# EAGLE design ESP32-S3 TFT Touch v1.1(3.5'' ili9488) (EAGLE 6.1)
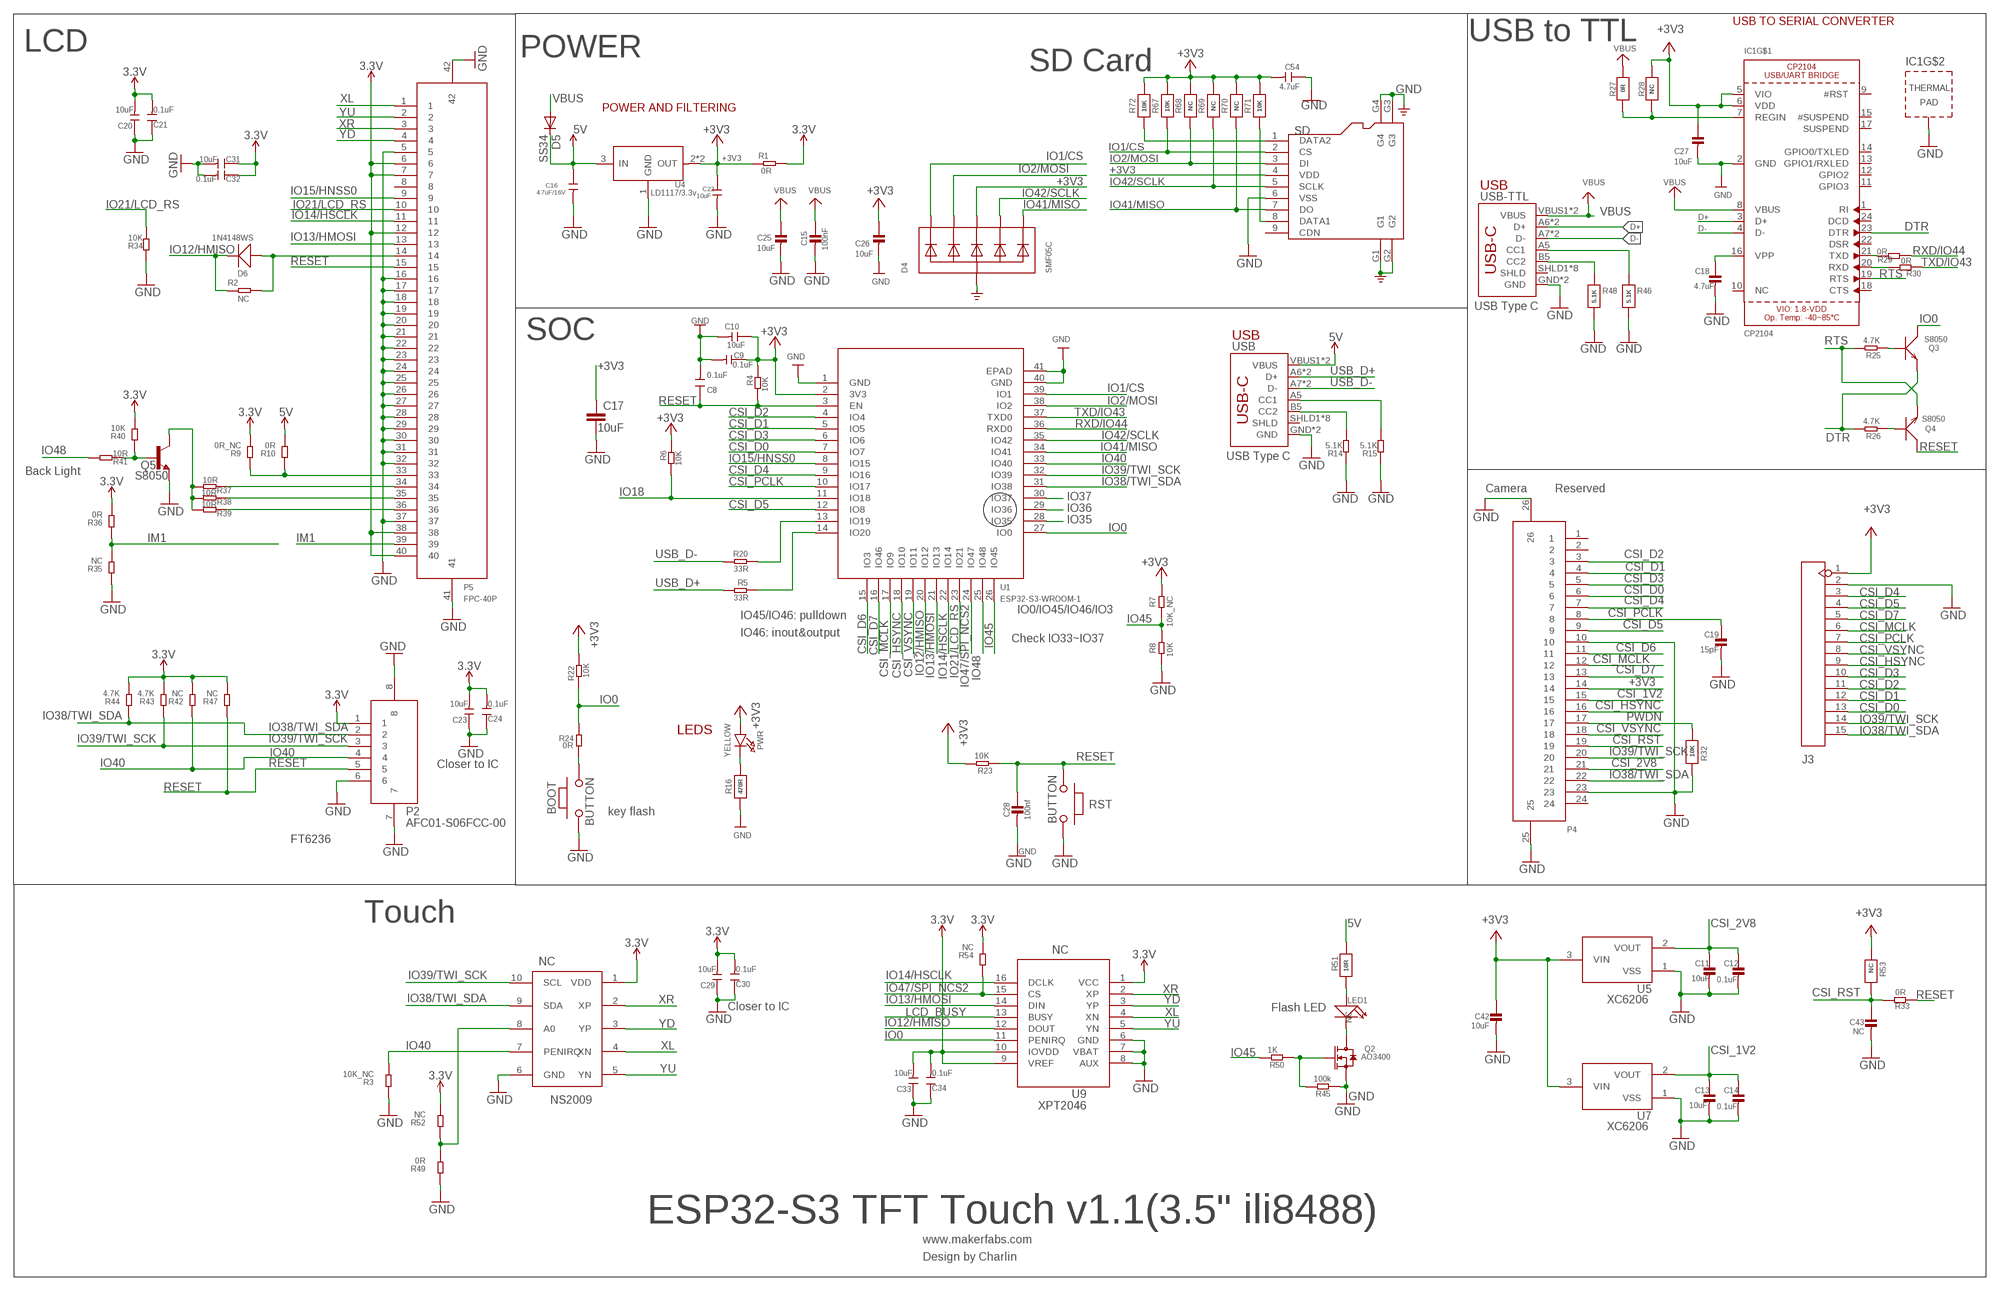
[diagram p0: schematic, sheet 1]

## Parts
BOOT  BUTTON  PB157  [157SW]
C8  0.1uF  DISCRETE_C-0603  [DISCRETE_C0603]
C9  0.1uF  DISCRETE_C-0603  [DISCRETE_C0603]
C10  10uF  DISCRETE_C-0603  [DISCRETE_C0603]
C11  10uF  CAP_CERAMIC0603_NO  [0603-NO]
C12  0.1uF  CAP_CERAMIC0603_NO  [0603-NO]
C13  10uF  CAP_CERAMIC0603_NO  [0603-NO]
C14  0.1uF  CAP_CERAMIC0603_NO  [0603-NO]
C15  100nF  CAP_CERAMIC0603_NO  [0603-NO]
C16  4.7uF/16V  C-0603  [0603]
C17  10uF  C-EUC0603  [C0603]
C18  4.7uF  CAP_CERAMIC0603_NO  [0603-NO]
C19  15pF  CAP_CERAMIC0603_NO  [0603-NO]
C20  10uF  DISCRETE_C-0603  [DISCRETE_C0603]
C21  0.1uF  DISCRETE_C-0603  [DISCRETE_C0603]
C22  10uF  C-0603  [0603]
C23  10uF  DISCRETE_C-0603  [DISCRETE_C0603]
C24  0.1uF  DISCRETE_C-0603  [DISCRETE_C0603]
C25  10uF  CAP_CERAMIC0603_NO  [0603-NO]
C26  10uF  CAP_CERAMIC0603_NO  [0603-NO]
C27  10uF  CAP_CERAMIC0603_NO  [0603-NO]
C28  100nf  CAP_CERAMIC0603_NO  [0603-NO]
C29  10uF  DISCRETE_C-0603  [DISCRETE_C0603]
C30  0.1uF  DISCRETE_C-0603  [DISCRETE_C0603]
C31  10uF  DISCRETE_C-0603  [DISCRETE_C0603]
C32  0.1uF  DISCRETE_C-0603  [DISCRETE_C0603]
C33  10uF  DISCRETE_C-0603  [DISCRETE_C0603]
C34  0.1uF  DISCRETE_C-0603  [DISCRETE_C0603]
C42  10uF  CAP_CERAMIC0603_NO  [0603-NO]
C43  NC  CAP_CERAMIC0603_NO  [0603-NO]
C54  4.7uF  DISCRETE_C-0603  [DISCRETE_C0603]
D4  SMF05C  TVSARRAY_5LANE  [SOT363]
D5  SS34  DIODE-DO-214AC  [DO-214AC]
D6  1N4148WS  D'0805'  [SOD323]
IC1  CP2104  [QFN24_4MM_SMSC]
J3  HEADER-1X15P  [SMD15-2.54P8.5H]
LED1  NC  DISCRETE_LED3528  [DISCRETE_LED-3528]
P2  AFC01-S06FCC-00  [SMD8-50P-740L535W]
P4  FPC-24P  [SMD26-50P-1760L450W]
P5  FPC-40P  [SMD42-50P-2560L490W]
PWR  YELLOW  LED0805_NOOUTLINE  [CHIPLED_0805_NOOUTLINE]
Q2  AO3400  MOSFET-N'SOT23'  [SOT23@1]
Q3  S8050  TRANSISTOR-NPN-SOT23  [SOT23]
Q4  S8050  TRANSISTOR-NPN-SOT23  [SOT23]
Q5  S8050  SPARKFUN_TRANSISTOR_NPNSOT23  [SPARKFUN_SOT23]
R1  0R  R-0603  [R0603]
R2  NC  R-0603  [R0603]
R3  10K_NC  DISCRETE_R-0603  [DISCRETE_R0603]
R4  10K  R-0603  [R0603]
R5  33R  R-0603  [R0603]
R6  10K  R-0603  [R0603]
R7  10K_NC  R-0603  [R0603]
R8  10K  R-0603  [R0603]
R9  0R_NC  DISCRETE_R-0603  [DISCRETE_R0603]
R10  0R  DISCRETE_R-0603  [DISCRETE_R0603]
R14  5.1K  DISCRETE_R-0603  [DISCRETE_R0603]
R15  5.1K  DISCRETE_R-0603  [DISCRETE_R0603]
R16  470R  RESISTOR_0603_NOOUT  [0603-NO]
R20  33R  R-0603  [R0603]
R22  10K  R-0603  [R0603]
R23  10K  R-0603  [R0603]
R24  0R  R-0603  [R0603]
R25  4.7K  R-0603  [R0603]
R26  4.7K  R-0603  [R0603]
R27  0R  RESISTOR_0603_NOOUT  [0603-NO]
R28  NC  RESISTOR_0603_NOOUT  [0603-NO]
R29  0R  R-0603  [R0603]
R30  0R  R-0603  [R0603]
R32  10K  RESISTOR_0603_NOOUT  [0603-NO]
R33  0R  R-0603  [R0603]
R34  10K  DISCRETE_R-0603  [DISCRETE_R0603]
R35  NC  DISCRETE_R-0603  [DISCRETE_R0603]
R36  0R  DISCRETE_R-0603  [DISCRETE_R0603]
R37  10R  DISCRETE_R-0603  [DISCRETE_R0603]
R38  10R  DISCRETE_R-0603  [DISCRETE_R0603]
R39  10R  DISCRETE_R-0603  [DISCRETE_R0603]
R40  10K  DISCRETE_R-0603  [DISCRETE_R0603]
R41  10R  DISCRETE_R-0603  [DISCRETE_R0603]
R42  NC  DISCRETE_R-0603  [DISCRETE_R0603]
R43  4.7K  DISCRETE_R-0603  [DISCRETE_R0603]
R44  4.7K  DISCRETE_R-0603  [DISCRETE_R0603]
R45  100k  R-0603  [R0603]
R46  5.1K  RESISTOR_0603_NOOUT  [0603-NO]
R47  NC  DISCRETE_R-0603  [DISCRETE_R0603]
R48  5.1K  RESISTOR_0603_NOOUT  [0603-NO]
R49  0R  DISCRETE_R-0603  [DISCRETE_R0603]
R50  1K  R-0603  [R0603]
R51  10R  RESISTOR_0603_NOOUT  [0603-NO]
R52  NC  DISCRETE_R-0603  [DISCRETE_R0603]
R53  NC  RESISTOR_0603_NOOUT  [0603-NO]
R54  NC  DISCRETE_R-0603  [DISCRETE_R0603]
R67  10K  RESISTOR_0603_NOOUT  [0603-NO]
R68  NC  RESISTOR_0603_NOOUT  [0603-NO]
R69  NC  RESISTOR_0603_NOOUT  [0603-NO]
R70  NC  RESISTOR_0603_NOOUT  [0603-NO]
R71  10K  RESISTOR_0603_NOOUT  [0603-NO]
R72  10K  RESISTOR_0603_NOOUT  [0603-NO]
RST  BUTTON  PB157  [157SW]
SD  HOLDER-MICROSD-9P  [9P-SMD-W/-RING]
U1  ESP32-S3-WROOM-1  [ESP32-S3-WROOM-1]
U4  LD1117/3.3v  LD1117'SOT89'  [SOT89]
U5  XC6206  [SOT-23]
U7  XC6206  [SOT-23]
U8  NS2009  [MSOP10]
U9  XPT2046  [TSSOP16-65P-560L910W]
USB  USB_C5  [USB-C-16P-5]
USB-TTL  USB_C5  [USB-C-16P-5]

## Nets
3.3V: C20.2 C21.2 C23.2 C24.2 C29.2 C30.2 C31.1 C32.1 C33.2 C34.2 P2.1 P5.6 P5.7 P5.12 P5.38 P5.40 R1.2 R9.2 R36.2 R40.2 R42.2 R43.2 R44.2 R47.2 R52.2 R54.2 U8.1(VDD) U9.1(VCC) U9.9(VREF) U9.10(IOVDD)
5V: C16.1 D5.C R10.2 R51.1 U4.3(IN) USB.VBUS1(VBUS) USB.VBUS2(VBUS)
+3V3: C9.1 C10.1 C17.1 C22.1 C26.1 C27.1 C42.1 C54.2 D4.4(C3) IC1.5(VIO) IC1.6(VDD) J3.1 P4.14 PWR.A R1.1 R4.2 R6.2 R7.2 R22.2 R23.2 R28.1 R53.1 R67.2 R68.2 R69.2 R70.2 R71.2 R72.2 SD.4(VDD) U1.2(3V3) U4.2(OUT) U4.4(OUT) U5.3(VIN) U7.3(VIN)
CSI_1V2: C13.1 C14.1 P4.15 U7.2(VOUT)
CSI_2V8: C11.1 C12.1 P4.21 U5.2(VOUT)
CSI_D0: J3.13 P4.6 U1.7(IO7)
CSI_D1: J3.12 P4.4 U1.5(IO5)
CSI_D2: J3.11 P4.3 U1.4(IO4)
CSI_D3: J3.10 P4.5 U1.6(IO6)
CSI_D4: J3.3 P4.7 U1.9(IO16)
CSI_D5: J3.4 P4.9 U1.12(IO8)
CSI_D6: P4.11 U1.15(IO3)
CSI_D7: J3.5 P4.13 U1.16(IO46)
CSI_HSYNC: J3.9 P4.16 U1.18(IO10)
CSI_MCLK: J3.6 P4.12 U1.17(IO9)
CSI_PCLK: C19.1 J3.7 P4.8 U1.10(IO17)
CSI_RST: C43.1 P4.19 R33.2 R53.2
CSI_VSYNC: J3.8 P4.18 U1.19(IO11)
D+: IC1.3(D+) USB-TTL.A6(D+) USB-TTL.B6(D+)
D-: IC1.4(D-) USB-TTL.A7(D-) USB-TTL.B7(D-)
DTR: IC1.23(DTR) Q3.2(E) R26.2
GND: BOOT.1 C8.2 C9.2 C10.2 C11.2 C12.2 C13.2 C14.2 C15.2 C16.2 C17.2 C18.2 C19.2 C20.1 C21.1 C22.2 C23.1 C24.1 C25.2 C26.2 C27.2 C28.2 C29.1 C30.1 C31.2 C32.2 C33.1 C34.1 C42.2 C43.2 C54.1 D4.2(A) IC1.2(GND) IC1.THERM(TP) J3.2 P2.6 P2.7 P2.8 P4.10 P4.23 P4.25 P4.26 P5.5 P5.16 P5.17 P5.18 P5.19 P5.20 P5.21 P5.22 P5.23 P5.24 P5.25 P5.26 P5.27 P5.28 P5.29 P5.30 P5.31 P5.32 P5.37 P5.41 P5.42 Q2.2(S) Q5.2(E) R3.1 R8.1 R14.1 R15.1 R16.1 R32.2 R34.1 R35.1 R45.1 R46.2 R48.2 R49.1 RST.1 SD.6(VSS) SD.G1 SD.G2 SD.G3 SD.G4 U1.1(GND) U1.40(GND) U1.41(EPAD) U4.1(GND) U5.1(VSS) U7.1(VSS) U8.6(GND) U9.6(GND) U9.7(VBAT) U9.8(AUX) USB-TTL.GND USB-TTL.GND2(GND) USB.GND USB.GND2(GND)
IM1: P5.39 R35.2 R36.1
IO0: Q3.3(C) R22.1 R24.2 U1.27(IO0) U9.11(PENIRQ)
IO1/CS: D4.1(C1) R67.1 SD.2(CS) U1.39(IO1)
IO2/MOSI: D4.3(C2) R68.1 SD.3(DI) U1.38(IO2)
IO12/HMISO: D6.- R2.1 U1.20(IO12) U9.12(DOUT)
IO13/HMOSI: P5.13 U1.21(IO13) U9.14(DIN)
IO14/HSCLK: P5.11 U1.22(IO14) U9.16(DCLK)
IO15/HNSS0: P5.9 U1.8(IO15)
IO18: R6.1 U1.11(IO18)
IO21/LCD_RS: P5.10 R34.2 U1.23(IO21)
IO35: U1.28(IO35)
IO36: U1.29(IO36)
IO37: U1.30(IO37)
IO38/TWI_SDA: J3.15 P2.2 P4.22 R44.1 U1.31(IO38) U8.9(SDA)
IO39/TWI_SCK: J3.14 P2.3 P4.20 R43.1 U1.32(IO39) U8.10(SCL)
IO40: P2.4 R3.2 R42.1 U1.33(IO40) U8.7(PENIRQ)
IO41/MISO: D4.6(C5) R70.1 SD.7(DO) U1.34(IO41)
IO42/SCLK: D4.5(C4) R69.1 SD.5(SCLK) U1.35(IO42)
IO45: R7.1 R8.2 R50.2 U1.26(IO45)
IO47/SPI_NCS2: R54.1 U1.24(IO47) U9.15(CS)
IO48: R41.2 U1.25(IO48)
LCD_BUSY: U9.13(BUSY)
N$1: C18.1 IC1.16(VPP)
N$2: Q4.1(B) R26.1
N$3: Q3.1(B) R25.1
N$4: D6.+ P5.14 R2.2
N$5: Q2.1(G) R45.2 R50.1
N$6: BOOT.2 R24.1
N$7: PWR.C R16.2
N$8: LED1.1(+) R51.2
N$9: LED1.2(-) Q2.3(D)
N$10: R46.1 USB-TTL.A5(CC1)
N$11: R48.1 USB-TTL.B5(CC2)
N$12: IC1.7(REGIN) R27.2 R28.2
N$14: R15.2 USB.A5(CC1)
N$15: R20.2 U1.13(IO19)
N$16: R5.2 U1.14(IO20)
N$17: R14.2 USB.B5(CC2)
N$18: IC1.21(TXD) R29.2
N$19: IC1.20(RXD) R30.2
N$20: P5.34 R37.1
N$21: P5.35 R38.1
N$22: P5.36 R39.1
N$23: Q5.1(B) R40.1 R41.1
N$24: Q5.3(C) R37.2 R38.2 R39.2
N$25: R49.2 R52.1 U8.8(A0)
N$26: P5.33 R9.1 R10.1
N$47: R72.1 SD.1(DATA2)
N$48: R71.1 SD.8(DATA1)
PWDN: P4.17 R32.1
RESET: C8.1 C28.1 P2.5 P5.15 Q4.3(C) R4.1 R23.1 R33.1 R47.1 RST.2 U1.3(EN)
RTS: IC1.19(RTS) Q4.2(E) R25.2
RXD/IO44: R29.1 U1.36(RXD0)
TXD/IO43: R30.1 U1.37(TXD0)
USB_D+: R5.1 USB.A6(D+) USB.B6(D+)
USB_D-: R20.1 USB.A7(D-) USB.B7(D-)
VBUS: C15.1 C25.1 D5.A IC1.8(VBUS) R27.1 USB-TTL.VBUS1(VBUS) USB-TTL.VBUS2(VBUS)
XL: P5.1 U8.4(XN) U9.4(XN)
XR: P5.3 U8.2(XP) U9.2(XP)
YD: P5.4 U8.3(YP) U9.3(YP)
YU: P5.2 U8.5(YN) U9.5(YN)
Unconnected: IC1.1(RI) IC1.9(#RST) IC1.10(NC) IC1.11(GPIO3) IC1.12(GPIO2) IC1.13(GPIO1/RXLED) IC1.14(GPIO0/TXLED) IC1.15(#SUSPEND) IC1.17(SUSPEND) IC1.18(CTS) IC1.22(DSR) IC1.24(DCD) P4.1 P4.2 P4.24 P5.8 SD.9(CDN) USB-TTL.SHLD1(SHLD) USB-TTL.SHLD2(SHLD) USB-TTL.SHLD3(SHLD) USB-TTL.SHLD4(SHLD) USB-TTL.SHLD5(SHLD) USB-TTL.SHLD6(SHLD) USB-TTL.SHLD7(SHLD) USB-TTL.SHLD8(SHLD) USB.SHLD1(SHLD) USB.SHLD2(SHLD) USB.SHLD3(SHLD) USB.SHLD4(SHLD) USB.SHLD5(SHLD) USB.SHLD6(SHLD) USB.SHLD7(SHLD) USB.SHLD8(SHLD)

## Notes on the sheet
- USB TO SERIAL CONVERTER
- USB to TTL
- LCD | POWER
- SD Card
- POWER AND FILTERING
- USB
- USB Type C
- SOC | USB
- USB Type C
- Back Light
- Camera | Reserved
- IO0/IO45/IO46/IO3
- IO45/IO46: pulldown
- IO46: inout&output
- Check IO33~IO37
- LEDS
- Closer to IC
- key flash
- FT6236
- Touch
- NC
- NC
- Closer to IC | Flash LED
- NS2009
- ESP32-S3 TFT Touch v1.1(3.5" ili8488)
- www.makerfabs.com
- Design by Charlin

## Library data of the parts
BOOT RST = MySMD:PB157
C8-C10 C20 C21 C23 C24 C29-C34 C54 = A9G:DISCRETE_C*: Ceramic Capacitors
C11-C15 C18 C19 C25-C28 C42 C43 = microbuilder:CAP_CERAMIC: Ceramic Capacitors For new designs, use the packages preceded by an '_' character since they are more reliable: The following footprints should be used on most boards: _0402 - Standard footprint for regular board layouts _0603 - Standard footprint for regular board layouts _0805 - Standard footprint for regular board layouts _1206 - Standard footprint for regular board layouts For extremely tight-pitch boards where space is at a premium, the following 'micro-pitch' footprints can be used (smaller pads, no silkscreen outline, etc.): _0402MP - Micro-pitch footprint for very dense/compact boards _0603MP - Micro-pitch footprint for very dense/compact boards _0805MP - Micro-pitch footprint for very dense/compact boards _1206MP - Micro-pitch footprint for very dense/compact boards
C16 C22 = Discrete:C*: Ceramic Capacitors
C17 = rcl:C-EU: CAPACITOR, European symbol
D4 = microbuilder:TVSARRAY_5LANE: Voltage Transient Suppressor Array SOT363 SMF05C - 100W 5V: Digikey - SMF05CT1GOSCT-ND
D5 = diode:DIODE-: DIODE
D6 = Discrete:D*
IC1 = microbuilder:CP2104: CP2104 - USB to UART Bridge VDD Output: 3.45V
J3 = self:HEADER-1X15P
LED1 = Relay:DISCRETE_LED*
P2 = self:AFC01-S06FCC-00
P4 = self:FPC-24P
P5 = self:FPC-40P
PWR = microbuilder:LED: LED 0603 - 0603 Surface Mount Package 2mA: Green LED - Low Power (3.9mcd, 2ma, 1.7Vf) - Digikey: 475-2709-2-ND Orange LED - Low Power (9.8mcd, 2ma, 1.8Vf) - Digikey: 475-1194-2-ND Red LED - Low Power (5mcd, 2ma, 1.8Vf) - Digikey: 475-1195-2-ND Yellow LED - Low Power (7mcd, 2ma, 1.8Vf) - Digikey: 475-1196-2-ND 5mA: Blue LED - Low Power (17mcd, 5ma, 2.9Vf) - Digikey: LNJ937W8CRACT-ND 0805 - 0805 Surface Mount Package 2mA: Red LED (8.8mcd, 2mA, 1.8Vf, Clear) - Low Power [Digikey: 475-2510-1-ND] Green LED (5mcd, 2mA, 1.8Vf, Clear) - Low Power [Digikey: 475-2730-1-ND] Yellow LED (11.3mcd, 2mA, 1.8Vf, Clear) - Low Power [Digikey: 475-2555-1-ND] 20mA: Red LED (104mcd, 20mA, Diffused) - LS R976 [Digikey: 475-1278-6-ND] Red LED (12mcd, 20mA, 2.0Vf, Clear) - APT2012EC [Digikey: 754-1128-1-ND] Green LED (15mcd, 20mA, 2.2Vf, Clear) - APT2012GC [Digikey: 754-1131-1-ND] Orange LED (160mcd, 20mA, 2.1Vf, Clear) - APT2012SECK [Digikey: 754-1130-1-ND] 1206 - 1206 Surface Mount Package Green LED (26mcd, 20mA, Diffused) - LG N971 [Digikey: 475-1407-6-ND] Red LED (15mcd, 20mA, Diffused) - LH N974 [Digikey: 475-1416-6-ND] Cree - Cree High-Power Surface Mount LEDs XPEBWT-L1-0000-00D50 - White 111lm 350mA 2.9Vf 6200K 110° XTEAWT-00-0000-00000LEE3 - White 114lm 350mA 2.85Vf 5000K 115° Everlight - Everlight 45-21 Series Surface Mount LEDs 45-21/QK2C-B2832AC2CB2/2T - Warm White 2000mcd 20mA 3.25Vf 3050K 120° 45-21/LK2C-B38452C4CB2/2T - Nuetral White 2000mcd 20mA 3.25Vf 4150K 120° 45-21/LK2C-B50634C6CB2/2T - Cold White 2200mcd 20mA 3.25Vf 5650K 120° PLCC2 Reverse Mount LS T77K-J1L2-1-0-2-R18-Z - Red 11.25mcd 2mA 1.8Vf 630nm 120° LO T77K-L1M2-24-Z - Orange 19.6mcd 2mA 1.8Vf 606nm 120° LY T77K-K2M1-26-Z - Yellow 15.7mcd 2mA 1.8Vf 587nm 120°
Q2 = Discrete:MOSFET-N: IRLL014: http://www.vishay.com/docs/91319/sihll014.pdf
Q3 Q4 = Discrete:TRANSISTOR-NPN*: NPN audion
Q5 = Adafruit_HUZZAH32_ESP32_Feather:SPARKFUN_TRANSISTOR_NPN: Transistor NPN BJT configuration in SOT23 package. MMBT2222 is the common NPN we use. Double check BCE configuration again layout.
R1 R2 R4-R8 R20 R22-R26 R29 R30 R33 R45 R50 = Discrete:R*
R3 R9 R10 R14 R15 R34-R44 R47 R49 R52 R54 = A9G:DISCRETE_R*
R16 R27 R28 R32 R46 R48 R51 R53 R67-R72 = microbuilder:RESISTOR: Resistors For new designs, use the packages preceded by an '_' character since they are more reliable: The following footprints should be used on most boards: _0402 - Standard footprint for regular board layouts _0603 - Standard footprint for regular board layouts _0805 - Standard footprint for regular board layouts _1206 - Standard footprint for regular board layouts For extremely tight-pitch boards where space is at a premium, the following 'micro-pitch' footprints can be used (smaller pads, no silkscreen outline, etc.): _0402MP - Micro-pitch footprint for very dense/compact boards _0603MP - Micro-pitch footprint for very dense/compact boards _0805MP - Micro-pitch footprint for very dense/compact boards _1206MP - Micro-pitch footprint for very dense/compact boards
SD = Connector:HOLDER-MICROSD-9P
U1 = self:ESP32-S3-WROOM-1
U4 = IC:LD1117: Low Drop Fixed And Adjustable Positive Voltage Regulators http://www.datasheetcatalog.org/datasheet/SGSThomsonMicroelectronics/mXuqtqv.pdf
U5 U7 = self:XC6206
U8 = NS2009:NS2009
U9 = self:XPT2046
USB USB-TTL = USBC:USB_C: USB Type C 16Pin Connector Super Speed pins not available on the 16-pin purely SMD connector so this part is best for USB 2.0 implementations. D1 and D2 are tied together enabling D+/- no matter which way the cable is plugged into the connector. The two channel configuration pins (CC1/2) are exposed. These are normally connected to ground via 5.1k resistors but can be reconfigured for high current/high power applications.

## Net classes
1 vbat: width 0.254 mm, drill 0.305 mm, clearance 0.152 mm

## Board
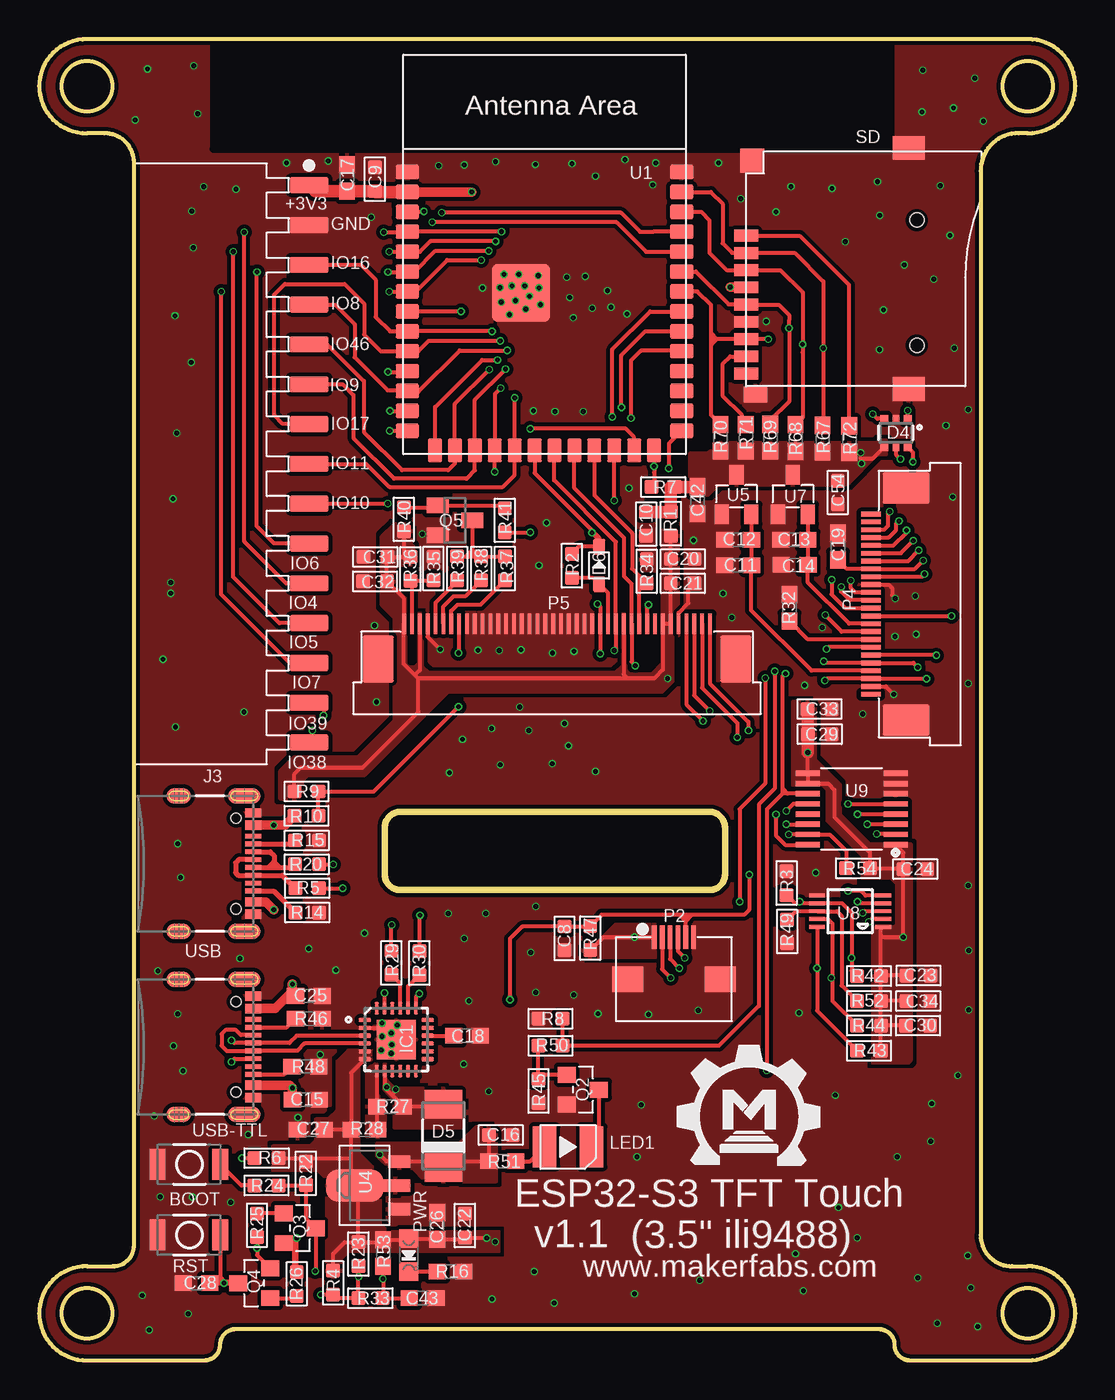
[diagram p1: board, top side]
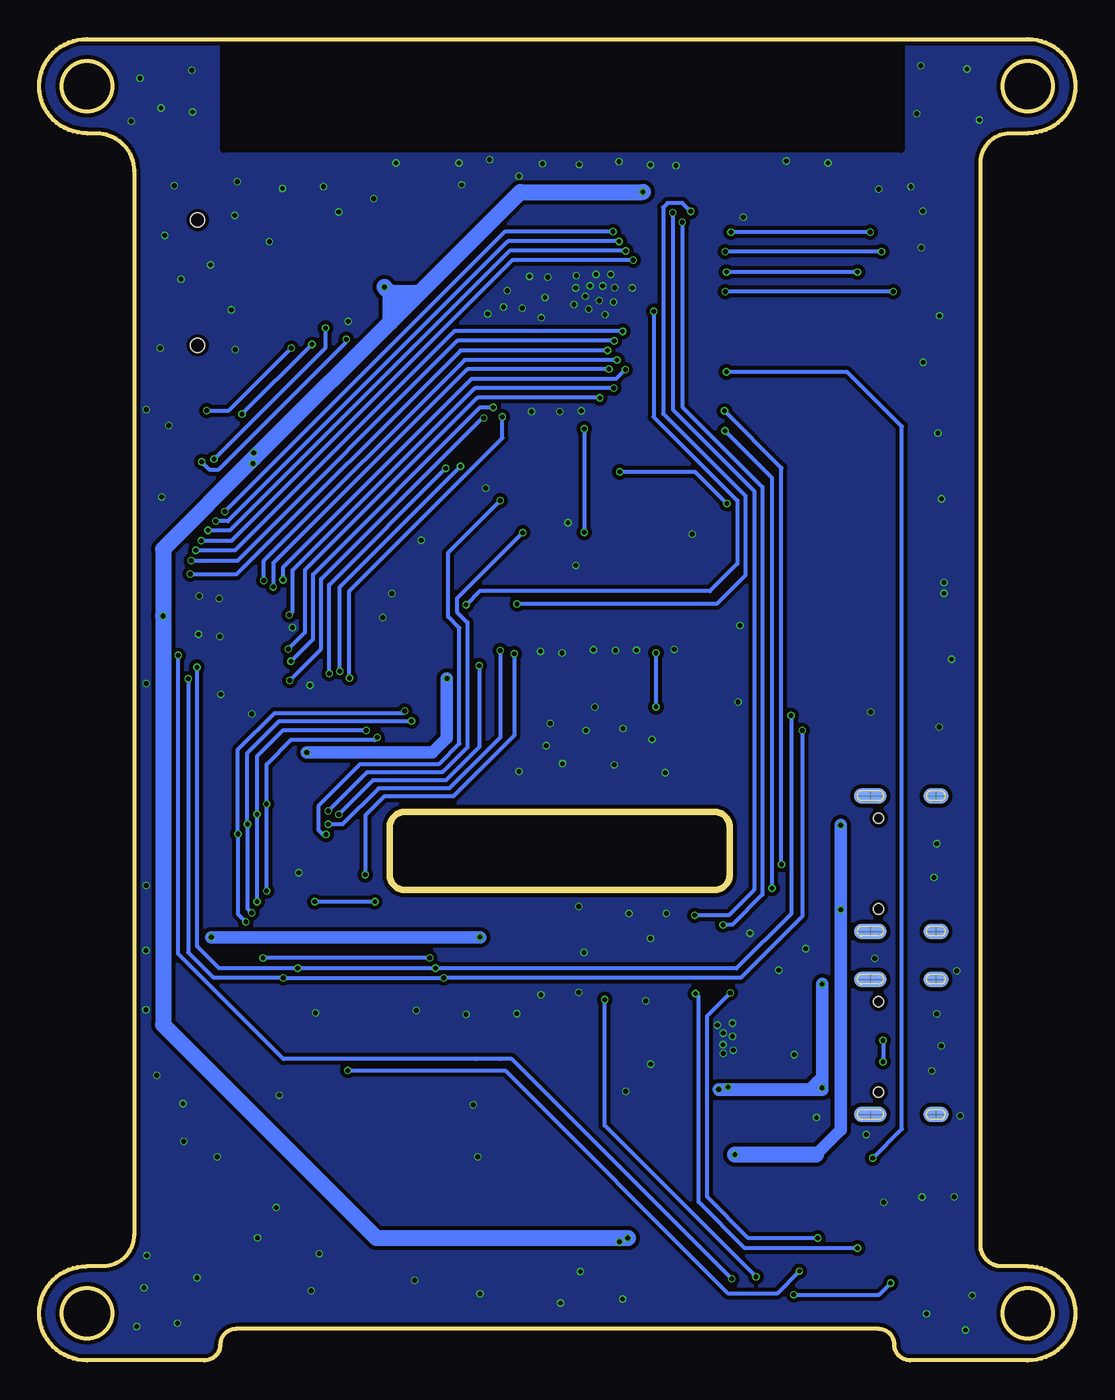
[diagram p2: board, bottom side, seen from below]

Size 66.1 x 84.3 mm. Coordinates in mm from the lower left corner, seen from the top.
Outline: 55.55,0 63.05,0 arc182 63.05,6 62.05,6 arc-90 60.05,8 60.05,75.9 arc-90 62.45,78.3 63.05,78.3 arc182 63.05,84.3 3.05,84.3 arc182 3.05,78.3 4.17,78.3 arc-90 6.05,76.42 6.05,7.34 arc-90 4.7,6 3.05,6 arc182 3.05,0 10.55,0 arc90 11.55,1 arc-90 12.55,2 53.55,2 arc-90 54.55,1 arc90 55.55,0
Outline: 23.05,35 42.75,35 arc-90 43.75,34 43.75,31 arc-90 42.75,30 23.05,30 arc-90 22.05,31 22.05,34 arc-90 23.05,35
Outline: circle at 3.05,81.3 radius 1.6
Outline: circle at 3.05,3 radius 1.6
Outline: circle at 63.05,3 radius 1.6
Outline: circle at 63.05,81.3 radius 1.6
Copper layers (1*16): Top 0.035mm / dielectric 1.5mm / Bottom 0.035mm
Design rules: minimum track width 6mil, minimum drill 10mil, track to track 8mil, track to pad 8mil, pad to pad 8mil, via to via 8mil, smd to smd 0mil, copper to edge 10mil, drill to drill 10mil, minimum pad ring 3mil, minimum via ring 3mil, stop-mask expansion 2mil, vias tented up to drill 100mil, thermal gap 0mil
tRestrict: area 11.1,77.3 to 54.3,85
bRestrict: area 11.1,77.3 to 54.3,85

### Footprints (pad centres in the part's own frame; a part is rotated, then mirrored left to right if it is on the bottom)
157SW = smd 1.016 x 1.981: 1 0,0; 2 4,0
DISCRETE_C0603 = smd 0.889 x 0.889: 1 -0.762,0; 2 0.762,0
0603-NO = smd 1.1 x 1: 1 -0.85,0; 2 0.85,0
0603 = smd 0.889 x 0.889: 1 -0.762,0; 2 0.762,0
C0603 = smd 1.1 x 1: 1 -0.85,0; 2 0.85,0
SOT363 = smd 0.5 x 0.5: 1 -0.75,-0.9; 3 0.75,-0.9; 4 0.75,0.9; 6 -0.75,0.9 | smd 0.4 x 0.5: 2 0,-0.9; 5 0,0.9
DO-214AC = smd 1.8 x 2.4: A 2.025,0; C -2.025,0
SOD323 = smd 1 x 0.8: + -1.2,0; - 1.2,0
QFN24_4MM_SMSC = smd 0.8 x 0.28: 1 -2,1.25; 2 -2,0.75; 3 -2,0.25; 4 -2,-0.25; 5 -2,-0.75; 6 -2,-1.25; 13 2,-1.25; 14 2,-0.75; 15 2,-0.25; 16 2,0.25; 17 2,0.75; 18 2,1.25 | smd 0.28 x 0.8: 7 -1.25,-2; 8 -0.75,-2; 9 -0.25,-2; 10 0.25,-2; 11 0.75,-2; 12 1.25,-2; 19 1.25,2; 20 0.75,2; 21 0.25,2; 22 -0.25,2; 23 -0.75,2; 24 -1.25,2 | smd 2.5 x 2.5: THERM 0,0
SMD15-2.54P8.5H = smd 1.02 x 2.5: 1 -17.78,0; 2 -15.24,0; 3 -12.7,0; 4 -10.16,0; 5 -7.62,0; 6 -5.08,0; 7 -2.54,0; 8 0,0; 9 2.54,0; 10 5.08,0; 11 7.62,0; 12 10.16,0; 13 12.7,0; 14 15.24,0; 15 17.78,0
DISCRETE_LED-3528 = smd 1.5 x 2.6: 1 -1.5,0; 2 1.5,0
SMD8-50P-740L535W = smd 0.3 x 1.5: 1 -1.25,0; 2 -0.75,0; 3 -0.25,0; 4 0.25,0; 5 0.75,0; 6 1.25,0 | smd 2 x 1.6: 7 2.95,-2.68; 8 -2.95,-2.68
SMD26-50P-1760L450W = smd 0.3 x 1.3: 1 5.75,0; 2 5.25,0; 3 4.75,0; 4 4.25,0; 5 3.75,0; 6 3.25,0; 7 2.75,0; 8 2.25,0; 9 1.75,0; 10 1.25,0; 11 0.75,0; 12 0.25,0; 13 -0.25,0; 14 -0.75,0; 15 -1.25,0; 16 -1.75,0; 17 -2.25,0; 18 -2.75,0; 19 -3.25,0; 20 -3.75,0; 21 -4.25,0; 22 -4.75,0; 23 -5.25,0; 24 -5.75,0 | smd 2 x 3: 25 -7.4,-2.25; 26 7.4,-2.25
SMD42-50P-2560L490W = smd 0.3 x 1.3: 1 9.75,0; 2 9.25,0; 3 8.75,0; 4 8.25,0; 5 7.75,0; 6 7.25,0; 7 6.75,0; 8 6.25,0; 9 5.75,0; 10 5.25,0; 11 4.75,0; 12 4.25,0; 13 3.75,0; 14 3.25,0; 15 2.75,0; 16 2.25,0; 17 1.75,0; 18 1.25,0; 19 0.75,0; 20 0.25,0; 21 -0.25,0; 22 -0.75,0; 23 -1.25,0; 24 -1.75,0; 25 -2.25,0; 26 -2.75,0; 27 -3.25,0; 28 -3.75,0; 29 -4.25,0; 30 -4.75,0; 31 -5.25,0; 32 -5.75,0; 33 -6.25,0; 34 -6.75,0; 35 -7.25,0; 36 -7.75,0; 37 -8.25,0; 38 -8.75,0; 39 -9.25,0; 40 -9.75,0 | smd 2 x 3: 41 -11.4,-2.25; 42 11.4,-2.25
CHIPLED_0805_NOOUTLINE = smd 1.2 x 1.2: A 0,-1.05; C 0,1.05
SOT23@1 = smd 1.016 x 1.143: 1 -0.95,-1.016; 2 0.95,-1.016; 3 0,1.016
SOT23 = smd 1.016 x 1.143: 1 -0.95,-1.016; 2 0.95,-1.016; 3 0,1.016
SPARKFUN_SOT23 = smd 1 x 1.4: 1 -0.95,-1.1; 2 0.95,-1.1; 3 0,1.1
R0603 = smd 0.889 x 0.889: 1 -0.762,0; 2 0.762,0
DISCRETE_R0603 = smd 0.889 x 0.889: 1 -0.762,0; 2 0.762,0
9P-SMD-W/-RING = smd 1.524 x 0.762: 1 0,4.4; 2 0,3.3; 3 0,2.2; 4 0,1.1; 5 0,0; 6 0,-1.1; 7 0,-2.2; 8 0,-3.3; 9 0,-4.4 | smd 1.524 x 1.016: G1 0.6,-5.746 | smd 2.032 x 1.524: G2 10.373,-5.4; G3 10.373,10 | smd 1.524 x 1.524: G4 0.392,9.181 | hole 0.889: 10.9,-2.6; 10.9,5.4
ESP32-S3-WROOM-1 = smd 1.5 x 0.9: 1 -8.75,5.26; 2 -8.75,3.99; 3 -8.75,2.72; 4 -8.75,1.45; 5 -8.75,0.18; 6 -8.75,-1.09; 7 -8.75,-2.36; 8 -8.75,-3.63; 9 -8.75,-4.9; 10 -8.75,-6.17; 11 -8.75,-7.44; 12 -8.75,-8.71; 13 -8.75,-9.98; 14 -8.75,-11.25; 27 8.75,-11.25; 28 8.75,-9.98; 29 8.75,-8.71; 30 8.75,-7.44; 31 8.75,-6.17; 32 8.75,-4.9; 33 8.75,-3.63; 34 8.75,-2.36; 35 8.75,-1.09; 36 8.75,0.18; 37 8.75,1.45; 38 8.75,2.72; 39 8.75,3.99; 40 8.75,5.26 | smd 0.9 x 1.5: 15 -6.985,-12.5; 16 -5.715,-12.5; 17 -4.445,-12.5; 18 -3.175,-12.5; 19 -1.905,-12.5; 20 -0.635,-12.5; 21 0.635,-12.5; 22 1.905,-12.5; 23 3.175,-12.5; 24 4.445,-12.5; 25 5.715,-12.5; 26 6.985,-12.5 | smd 3.7 x 3.7: 41 -1.5,-2.46
SOT89 = smd 0.8 x 1.4: 1 -1.524,-1.905; 3 1.524,-1.905 | smd 0.8 x 1.9: 2 0,-1.651 | smd 2.032 x 3.65: 4 0,0.94
SOT-23 = smd 0.9 x 1.25: 1 -0.95,-1.25; 2 0.95,-1.25; 3 0,1.25
MSOP10 = smd 0.25 x 1: 1 -1,-2.113; 2 -0.5,-2.113; 3 0,-2.113; 4 0.5,-2.113; 5 1,-2.113; 6 1,2.113; 7 0.5,2.113; 8 0,2.113; 9 -0.5,2.113; 10 -1,2.113
TSSOP16-65P-560L910W = smd 1.6 x 0.35: 1 -2.8,2.275; 2 -2.8,1.625; 3 -2.8,0.975; 4 -2.8,0.325; 5 -2.8,-0.325; 6 -2.8,-0.975; 7 -2.8,-1.625; 8 -2.8,-2.275; 9 2.8,-2.275; 10 2.8,-1.625; 11 2.8,-0.975; 12 2.8,-0.325; 13 2.8,0.325; 14 2.8,0.975; 15 2.8,1.625; 16 2.8,2.275
USB-C-16P-5 = smd 0.3 x 1: A5 -1.25,-0.34; A6 -0.25,-0.34; A7 0.25,-0.34; A8 1.25,-0.34; B5 1.75,-0.34; B6 0.75,-0.34; B7 -0.75,-0.34; B8 -1.75,-0.34 | smd 0.6 x 1: GND -3.225,-0.34; GND2 3.225,-0.34; VBUS1 -2.45,-0.34; VBUS2 2.45,-0.34 | smd 1 x 2.1: SHLD1 -4.32,-0.915; SHLD2 4.32,-0.915 | smd 1 x 2.1 bottom: SHLD3 -4.32,-0.915; SHLD4 4.32,-0.915 | smd 1 x 1.6: SHLD5 -4.32,-5.095; SHLD8 4.32,-5.095 | smd 1 x 1.6 bottom: SHLD6 -4.32,-5.095; SHLD7 4.32,-5.095 | hole 0.65: -2.89,-1.445; 2.89,-1.445

### Placement (x,y rotation side)
BOOT  7.55,12.5 0 top
C8  33.51,26.92 270 top
C9  21.42,75.36 90 top
C10  38.71,53.37 270 top
C11  44.58,50.74 180 top
C12  44.58,52.36 180 top
C13  48.17,52.35 180 top
C14  48.18,50.75 180 top
C15  17.01,16.64 0 top
C16  29.44,14.38 0 top
C17  19.64,75.44 90 top
C18  27.29,20.71 0 top
C19  50.95,51.92 90 top
C20  41.05,51.13 180 top
C21  41.05,49.58 180 top
C22  27.15,8.6 90 top
C23  56.09,24.55 180 top
C24  55.88,31.35 180 top
C25  17.2,23.25 0 top
C26  25.39,8.58 90 top
C27  17.33,14.72 180 top
C28  10.03,4.92 180 top
C29  49.79,39.96 180 top
C30  56.05,21.36 180 top
C31  21.44,51.26 180 top
C32  21.42,49.7 180 top
C33  49.77,41.56 180 top
C34  56.07,22.92 180 top
C42  41.99,54.89 270 top
C43  24.46,3.98 0 top
C54  50.94,55.37 90 top
D4  54.64,59.18 180 top
D5  25.78,14.33 90 top
D6  35.72,50.72 90 top
IC1  22.78,20.46 0 top
J3  17.22,57.2 270 top
LED1  33.74,13.61 0 top
P2  40.49,27 0 top
P4  53.05,48.25 90 top
P5  33.03,47 0 top
PWR  23.57,6.72 180 top
Q2  34.68,17.27 270 top
Q3  16.63,8.43 270 top
Q4  13.71,4.92 90 top
Q5  26.51,53.6 270 top
R1  40.29,53.39 270 top
R2  33.98,50.7 270 top
R3  47.68,30.45 270 top
R4  18.75,4.95 90 top
R5  17.1,30.12 0 top
R6  14.51,12.9 0 top
R7  39.8,55.73 0 top
R8  32.62,21.79 0 top
R9  17.05,36.3 180 top
R10  17.05,34.75 180 top
R14  17.1,28.57 180 top
R15  17.07,33.17 180 top
R16  26.24,5.66 180 top
R20  17.07,31.65 0 top
R22  17.01,11.93 90 top
R23  20.36,6.78 90 top
R24  14.5,11.16 0 top
R25  13.89,8.61 270 top
R26  16.43,4.88 90 top
R27  22.38,16.19 180 top
R28  20.75,14.72 0 top
R29  22.47,25.36 270 top
R30  24.25,25.35 270 top
R32  47.86,48.02 90 top
R33  21.12,3.96 0 top
R34  38.75,50.35 270 top
R35  25.14,50.52 270 top
R36  23.67,50.5 90 top
R37  29.7,50.53 90 top
R38  28.19,50.53 90 top
R39  26.66,50.53 90 top
R40  23.26,53.66 270 top
R41  29.7,53.6 270 top
R42  52.93,24.52 0 top
R43  52.93,19.76 0 top
R44  52.93,21.36 0 top
R45  31.85,17.19 90 top
R46  17.2,21.8 0 top
R47  35.15,26.93 270 top
R48  16.98,18.75 0 top
R49  47.71,27.36 90 top
R50  32.62,20.07 0 top
R51  29.55,12.71 0 top
R52  52.93,22.93 0 top
R53  21.94,6.85 270 top
R54  52.23,31.39 0 top
R67  49.97,58.8 270 top
R68  48.25,58.86 270 top
R69  46.63,58.87 270 top
R70  43.46,58.86 270 top
R71  45.07,58.86 270 top
R72  51.67,58.78 270 top
RST  7.55,8 0 top
SD  45.09,67.36 0 top
U1  32.24,70.56 0 top
U4  21.07,11.16 90 top
U5  44.48,55.24 0 top
U7  48.07,55.24 0 top
U8  51.73,28.66 90 top
U9  51.82,35.18 180 top
U$1  [MAKERFABS_0.3]  41.16,12.48 0 top
USB  14,31.7 270 top
USB-TTL  14,20 270 top

### Tracks (layer width: path | path; a pad name or v marks a point on that pad's centre or on a via)
3.3V  (via drill 0.3)  (1 unrouted)
  Top 0.254: R47.2 35.98,27 P2.1 38.56,27 | C24.2 55.12,32.4 U9.1 | C24.2 55.08,31.39 R54.2 52.99,32.41 50.73,34.67 50.73,36.4 50.32,36.8 U9.10 U9.9 C29.2 | R1.2 C20.2 C21.2 P5.6 P5.7 39.78,44.07 39.22,43.51 37.54,43.51 | 37.54,43.51 24.18,43.51 | 24.18,43.51 23.97,43.73 | 23.97,43.73 23.27,44.42 23.27,46.99 P5.40 23.28,48.6 C32.1 22.18,51.24 C31.1 23.14,51.26 | P5.38 24.28,44.04 23.97,43.73 | P5.12 37.28,43.77 37.54,43.51 | R9.2 16.28,37.41 16.69,37.82 20.63,37.82 24.18,41.38 24.18,43.51 | 23.14,51.26 R36.2 | R40.2 23.26,51.38 23.14,51.26 | R43.2 R44.2 | R44.2 R42.2 | R42.2 53.69,27.13 | 53.69,27.13 53.69,27.51 U8.1 | C23.2 53.73,24.55 R42.2 | C34.2 R52.2 R44.2 | C30.2 R44.2 | C24.2 55.11,31.34 v55.11,27 53.82,27 53.69,27.13
  Top 0.813: v49.03,38.79 49.03,41.55 C33.2
  Bottom 0.813: v40.08,43.51 40.08,39.73 41.02,38.79 v49.03,38.79 | v37.98,27 55.12,27
  pour Top: 53.19,18.97 53.19,27.46 53.39,27.66 54.59,27.66 54.74,27.81 54.74,30.4 54.36,30.78 52.53,30.78 52.53,32.18 50.29,34.42 50.29,36.4 49.99,36.7 48.09,36.7 48.09,42.04 49.48,42.04 49.48,38.33 51.06,36.75 51.06,34.82 52.94,32.94 55.5,32.94 55.58,32.94 55.58,19.13 55.55,19.1 55.43,18.97
  pour Top: 39.75,52.98 39.75,44.45 39.07,43.76 37.67,43.76 37.42,44.02 37.42,47.6 37.21,47.6 37.21,44.3 36.76,43.84 24.84,43.84 24.44,44.25 24.44,47.62 24.21,47.62 24.21,44.45 23.96,44.2 23.57,44.2 23.4,44.37 23.4,48.59 22.61,49.38 22.61,50.47 22.81,50.67 22.91,50.77 24.03,50.77 24.03,51.74 23.73,52.04 23.73,53.34 22.63,53.34 21.82,52.53 21.82,48.23 22.66,47.4 22.66,40.79 20.32,38.46 16.23,38.46 15.34,37.57 15.34,35.86 16.77,35.86 16.77,37.01 17.12,37.36 20.78,37.36 24.13,40.72 26.09,42.67 39.73,42.67 40.41,43.36 40.41,47.88 40.77,48.23 40.77,52.98
  pour Top: 39.3,27.79 36.76,27.79 35.64,26.67 34.7,26.67 34.7,25.73 39.22,25.73 39.3,25.73
5V  (via drill 0.3)
  Top 0.254: 25.84,12.69 U4.3 22.16,12.69 v21.72,13.13 | 25.84,12.69 28.67,12.69 R51.1 28.7,14.37 C16.1 | D5.C 25.78,12.63 25.84,12.69
  Top 0.61: USB.VBUS2 14.47,29.25 v14.96,28.75 | USB.VBUS1 v14.96,34.15 15.69,34.15 R10.2
  Bottom 0.813: 16.54,13.13 14.96,14.71 v14.96,28.75 v14.96,34.15
  Bottom 1.016: v21.72,13.13 16.54,13.13
  pour Top: 21.54,13.82 21.54,13.08 22.35,12.27 23.83,12.27 24.67,11.43 29.16,11.43 29.16,14.86 27.84,14.86 26.8,13.82
+3V3  (via drill 0.3)
  Top 0.254: IC1.5 IC1.6 19.9,18.34 R28.1 | R28.1 C27.1 | U4.4 19.9,11.4 19.9,12.93 | 19.9,12.93 R28.1 | 19.9,12.93 19.87,12.9 16.95,12.9 | U4.4 U4.2 | R23.2 20.36,10.93 U4.4 | R23.2 21.78,7.54 R53.1 23.5,7.7 PWR.A 25.35,7.77 C26.1 27.04,7.73 C22.1 27.19,7.8 v28.55,7.8 | R6.2 16.95,12.9 | R22.2 17.01,12.83 16.95,12.9 | 45.07,68.48 SD.4 | P4.14 v58.19,47.5 | D4.4 53.13,57.52 52.44,57.52 52.4,57.56 | R4.2 18.75,6.81 19.49,7.54 R23.2
  Top 0.61: U1.2 v27.59,74.55 | 45.07,68.48 v44.07,68.48
  Top 0.813: U1.2 21.46,74.55 C9.1 C17.1 17.61,74.59 J3.1 | C10.1 40.29,54.13 R1.1 40.29,55.73 R7.2 42,55.73 C42.1
  Bottom 0.254: 52.4,57.56 52.45,57.51 v52.45,57.23
  Bottom 1.016: 41.84,68.12 35.41,74.55 v27.59,74.55 | 41.84,68.12 42.62,67.33 | 42.62,67.33 52.4,57.56 58.19,51.77 v58.19,47.5 58.19,21.41 44.58,7.8 v28.55,7.8 | v44.07,68.48 42.93,67.33 42.62,67.33 | v44.07,68.48 43.72,68.12 41.84,68.12 | v44.07,68.48 43.69,68.1 43.69,66.24
  other vias: 52.4,57.91 29.09,7.57
  pour Top: 41.51,55.17 42.6,55.17 43.31,55.88 51.54,55.88 53.47,57.81 54.03,57.81 54.03,58.7 53.6,58.7 53.42,58.52 43.06,58.52 42.98,58.45 42.98,58.19 42.65,57.86 41.53,57.86 41.51,57.84
  pour Top: 21.16,19.81 19.76,19.81 19,19.05 19,15.93 18.44,15.37 17.63,15.37 17.63,14 17.27,13.64 14.89,13.64 14.89,12.14 17.78,12.14 18.34,11.58 18.34,5.33 19.23,5.33 19.23,6.48 19.74,6.99 29.31,6.99 29.31,8.18 22.25,8.18 21.75,8.69 21.75,10.34 22.13,10.72 23.6,10.72 23.6,11.58 22,11.58 20.4,13.18 20.4,18.82 20.78,19.2 21.14,19.2 21.16,19.2
CSI_1V2
  Top 0.254: U7.2 C13.1 49.02,50.77 C14.1 49.03,50.74 49.03,49.63 51.66,47 P4.15
CSI_2V8
  Top 0.254: U5.2 C12.1 C11.1 45.42,50.72 45.42,47.85 49.27,44 P4.21
CSI_D0  (via drill 0.3)
  Top 0.254: J3.13 15.98,44.5 11.61,48.87 v11.61,68.2 | v22.33,68.2 U1.7 24.01,68.2 26.01,70.21 v28.2,70.21 | P4.6 54.96,51.5 v55.76,52.3
  Bottom 0.254: v11.61,68.2 v22.33,68.2 | v55.76,52.3 53.83,52.3 35.92,70.21 v28.2,70.21
CSI_D1  (via drill 0.3)
  Top 0.254: J3.12 15.32,47.04 12.37,49.99 v12.37,70.74 | v22.33,70.74 U1.5 24.29,70.74 24.95,71.4 v29.11,71.4 | P4.4 54.18,52.5 54.66,52.98 54.66,53.37 v54.84,53.54
  Bottom 0.254: v12.37,70.74 v22.33,70.74 | v54.84,53.54 54.05,53.54 36.2,71.4 v29.11,71.4
CSI_D2  (via drill 0.3)
  Top 0.254: J3.11 15.75,49.58 13.08,52.25 v13.08,71.98 | v21.97,71.98 23.46,71.98 U1.4 | P4.3 53.89,53 54.16,53.26 54.16,54.05 v54.26,54.15 | 23.69,71.81 U1.4 | v29.49,72.01 U1.4
  Bottom 0.254: v13.08,71.98 v21.97,71.98 | v54.26,54.15 36.4,72.01 v29.49,72.01
CSI_D3  (via drill 0.3)
  Top 0.254: J3.10 14.99,52.12 13.87,53.24 13.87,69.42 v13.9,69.44 | v22.25,69.44 23.46,69.44 U1.6 23.96,69.47 25.28,70.79 v28.68,70.79 | P4.5 54.49,52 55.32,52.83 v55.32,52.96
  Bottom 0.254: v13.9,69.44 v22.25,69.44 | v55.32,52.96 53.93,52.96 36.1,70.79 v28.68,70.79
CSI_D4  (via drill 0.3)
  Top 0.254: J3.3 20.53,69.9 21.47,68.96 21.47,66.57 22.38,65.66 U1.9 v28.88,65.66 | P4.7 55.42,51 v56.11,51.69
  Bottom 0.254: v28.88,65.66 39.63,65.66 53.6,51.69 v56.11,51.69
CSI_D5  (via drill 0.3)
  Top 0.254: J3.4 18.88,67.36 20.12,66.12 20.12,64.01 22.23,61.9 23.44,61.9 U1.12 23.54,61.8 24.18,61.8 26.83,64.44 v29.85,64.44 | P4.9 56.3,50 v56.47,50.16
  Bottom 0.254: v56.47,50.16 53.5,50.16 39.22,64.44 v29.85,64.44
CSI_D6  (via drill 0.3)
  Top 0.254: P4.11 52.04,49 51.77,49.28 v51.77,49.76 | U1.15 25.25,60.83 28.25,63.83 v29.24,63.83
  Bottom 0.254: v51.77,49.76 51.77,51.03 38.97,63.83 v29.24,63.83
CSI_D7  (via drill 0.3)
  Top 0.254: J3.5 18.37,64.82 20.7,62.48 20.7,59.23 23.14,56.79 26.09,56.79 26.52,57.23 U1.16 26.52,61.04 v28.71,63.22 | v50.55,49.81 50.55,48.87 51.41,48.01 P4.13
  Bottom 0.254: v28.71,63.22 29.29,62.64 38.51,62.64 50.55,50.6 v50.55,49.81
CSI_HSYNC  (via drill 0.3)
  Top 0.254: J3.9 v22.23,54.66 | v29.06,56.69 U1.18 29.09,58.09 29.09,61.67 v29.44,62.03 | P4.16 51.19,46.5 v50.14,47.55
  Bottom 0.254: v29.44,62.03 38.31,62.03 49.94,50.39 49.94,47.75 v50.14,47.55 | v22.23,54.66 24.26,56.69 v29.06,56.69
CSI_MCLK  (via drill 0.3)
  Top 0.254: J3.6 19.36,62.28 20.04,61.59 20.04,58.85 22.63,56.26 27.26,56.26 27.79,56.79 U1.17 27.79,61.29 v29.75,63.25 | P4.12 51.71,48.5 51.16,49.05 v51.16,49.35
  Bottom 0.254: v29.75,63.25 38.79,63.25 51.16,50.88 v51.16,49.35
CSI_PCLK  (via drill 0.3)
  Top 0.254: J3.7 15.55,59.74 14.99,60.3 14.99,68 15.68,68.68 19.49,68.68 20.73,67.44 20.73,65.46 21.8,64.39 U1.10 24.19,64.39 24.84,65.05 v29.42,65.05 | C19.1 51.52,50.5 P4.8 55.86,50.5 v56.39,51.03
  Bottom 0.254: v56.39,51.03 53.44,51.03 39.42,65.05 v29.42,65.05
CSI_RST  (via drill 0.3)
  Top 0.254: C43.1 23.59,3.96 R33.2 21.94,4.01 R53.2 21.94,5.22 v21.92,5.21 | v57.23,44.98 57.21,45 P4.19
  Bottom 0.254: v57.23,44.98 57.23,25.93 50.52,19.23 38.23,19.23 36.68,19.23 35.94,19.23 v21.92,5.21
CSI_VSYNC  (via drill 0.3)
  Top 0.254: v30.33,61.42 U1.19 30.33,56.49 29.57,55.73 22.33,55.73 20.86,57.2 J3.8 | P4.18 50.33,45.5 v50.22,45.39
  Bottom 0.254: v30.33,61.42 38.15,61.42 49.13,50.44 49.13,46.48 v50.22,45.39
D+  (via drill 0.3)
  Top 0.254: IC1.3 16.42,20.71 15.95,20.24 USB-TTL.A6 12.44,20.25 v12.27,20.42 | v12.27,19.05 12.47,19.25 USB-TTL.B6
  Bottom 0.254: v12.27,20.42 v12.27,19.05
D-
  Top 0.254: IC1.4 16.92,20.21 16.46,19.76 13.67,19.76 USB-TTL.A7 13.64,19.74 11.97,19.74 11.64,20.07 11.64,20.83 11.89,21.08 12.53,21.08 12.86,20.75 USB-TTL.B7
DTR  (via drill 0.3)
  Top 0.254: v22.03,23.44 IC1.23 | Q3.2 15.61,7.53 15.88,7.8 v16.44,7.8 | R26.2 v16.43,7.79 v16.44,7.8 | 16.23,5.84 16.23,7.77 16.41,7.77 v16.44,7.8
  Bottom 0.254: v22.03,23.44 23.5,21.97 23.5,10.44 20.86,7.8 v16.44,7.8
GND  (via drill 0.3)
  Top 0.254: IC1.2 22.03,21.21 IC1.THERM | P5.37 24.78,46.16 v25.58,45.36 | P5.5 40.78,47.69 41.41,48.31 41.41,49.17 C21.1 | P4.23 54.01,43 v54.51,42.49 | P4.10 54.19,49.5 54.41,49.28 54.41,48.82 v54.61,48.62
  other vias: 7.57,24.84 7.34,15.6 7.01,1.93 6.58,4.14 7.72,10.44 9.5,2.97 57.28,2.36 59.29,22.35 59.26,43.18 59.26,60.66 58.32,79.91 59.67,81.81 56.37,82.32 56.31,79.65 60.23,79.07 53.47,75.21 57.48,74.96 29.11,76.48 7.9,44.73 10.11,79.55 9.86,82.6 6.91,82.4 12.55,74.73 59.26,30.3 59.29,26.16 56.87,13.97 58.6,18.19 49.94,46.76 55.93,46.33 55.88,48.77 35.49,75.56 33.84,67.82 34.83,69.16 36.48,67.21 31.83,69.22 30.58,69.29 29.64,69.29 29.39,68.45 30.15,68.55 30.97,68.55 31.88,68.43 31.98,67.36 31.27,67.89 30.38,67.61 29.47,67.51 30,66.73 31.04,67.08 33.66,69.11 35.28,67.13 34.06,66.52 28.27,68.43 32.9,60.53 34.7,60.53 31.52,60.58 36.25,68.25 37.49,66.78 50.57,74.78 53.62,73.05 57.05,68.99 58.09,71.78 58.37,64.59 55.17,69.9 47.96,74.88 37.37,76.61 43.34,76.4 39.14,75.01 39.32,76.4 33.99,76.35 31.65,76.3 27.1,76.28 25.48,76.23 18.44,76.53 15.78,76.4 6.12,79.15 9.73,73.33 10.49,74.88 21.19,72.95 46.38,66.29 27.99,45.31 30.74,45.34 34.12,45.24 32.74,45.14 29.34,45.29 26.16,37.49 29.42,38 32.72,38.07 33.51,40.64 30.66,41.68 27,39.62 31.22,40.18 28.86,40.31 35.49,37.57 33.76,39.22 13.06,41.38 8.69,40.41 8.38,48.95 8.38,49.63 8.66,66.65 8.77,59.16 8.54,54.97 9.71,63.68 9.83,70.99 8.84,32.97 9.02,30.81 8.56,20.07 8.84,22.1 9.17,18.47 12.8,25.65 13.34,14.4 17.2,26.26 18.93,24.89 21.87,21.51 21.87,20.68 21.82,19.79 22.46,19.58 22.48,20.14 22.46,20.88 22.84,21.39 27.41,22.94 28.68,17.17 27.08,18.9 27.1,26.92 28.48,28.52 26.09,28.52 35.64,22.12 38.86,22.07 42.04,22.33 34.09,23.32 31.68,23.47 31.35,26.04 31.68,28.96 48.47,22.17 49.53,31.11 50.78,16.92 38.41,16.31 38.13,12.98 31.58,5.66 28.88,3.91 42.14,5.11 59.41,4.62 59.87,2.16 56.04,5.26 59.24,6.68 54.74,12.98 56.92,16.38 50.98,9.75 52.17,7.82 48.24,6.81 48.75,4.45 32.85,3.66 37.98,4.24 9.78,10.41 12.22,10.08 17.94,19.51 16.51,15.49 20.75,27.25 21.52,42.01 21.39,46.89 31.88,50.72 32.36,53.44 24.44,52.73 37.62,55.65 41.74,52.32 43.61,48.92 44.17,47.4 48.82,43.08 52.53,41.25 54.59,46.18 58.27,55.09 57.84,59.64 53.6,64.49 53.85,67.03 51.41,71.37 44.76,74.12 46.99,73.28
  pour Top (isolate 0.254, rank 6): -0.95,85 -0.95,0 66.05,0 66.05,85
  pour Bottom (isolate 0.254, rank 6): 0.05,0 66.05,0 66.05,85 0.05,85
IM1
  Top 0.254: R35.2 25.12,49.74 R36.1 23.78,49.63 P5.39
IO0  (via drill 0.3)
  Top 0.254: R24.2 17,11.16 R22.1 17.01,9.06 Q3.3 17.64,5.73 v17.61,5.69 | U9.11 49.01,36.17 47.73,36.17 | U1.27 40.16,58.49 v40.16,56.92 | 47.73,36.17 47.43,36.17 | 47.43,36.17 46.41,35.15 v46.41,18.49 | 47.43,36.17 47.43,43.64 v47.6,43.81 | 47.45,36.45 47.73,36.17
  Bottom 0.254: v40.16,56.92 47.6,49.48 v47.6,43.81 | v46.41,18.49 36.38,18.49 22.18,4.29 19,4.29 v17.61,5.69
IO1/CS  (via drill 0.3)
  Top 0.254: U1.39 42.85,74.55 43.59,73.81 43.59,71.27 44.2,70.66 SD.2 | SD.2 | SD.2 48.19,70.66 50.02,68.83 v50.02,64.59 50.02,64.52 50.02,59.7 R67.1 | D4.1 v55.39,60.6 v55.4,60.6
  Bottom 0.254: v55.4,60.6 54,60.6 v50.02,64.59
IO2/MOSI  (via drill 0.3)
  Top 0.254: 48.26,59.73 R68.1 48.7,60.16 48.7,64.31 v48.7,64.82 48.7,68.15 47.28,69.56 SD.3 43.84,69.57 42.75,70.66 42.75,72.75 42.22,73.28 U1.38 | D4.3 53.46,60.08 v53.17,60.38
  Bottom 0.254: v53.17,60.38 48.72,64.82 v48.7,64.82
IO12/HMISO  (via drill 0.3)
  Top 0.254: U1.20 31.6,56.62 35.72,52.5 D6.- | D6.- 34.43,51.92 R2.1 | D6.- 35.72,52.35 v35.26,52.81 | U9.12 48.11,35.5 v47.65,35.05
  Bottom 0.254: v35.26,52.81 39.45,48.62 39.45,47.75 38.79,47.09 38.79,39.12 40.39,37.52 45.19,37.52 v47.65,35.05
IO13/HMOSI  (via drill 0.3)
  Top 0.254: U1.21 32.85,58.04 32.85,56.16 36.78,52.22 P5.13 36.78,45.39 v36.68,45.29 | v47.65,34.21 v47.66,34.2 U9.14
  Bottom 0.254: v36.68,45.29 36.68,39.75 39.93,36.5 44.45,36.5 46.74,34.21 v47.65,34.21
IO14/HSCLK  (via drill 0.3)
  Top 0.254: U1.22 34.14,55.65 37.32,52.48 37.32,50.01 37.78,49.55 P5.11 37.78,44.57 v38.03,44.32 | U9.16 47.58,32.89 46.99,33.48 v46.99,34.82
  Bottom 0.254: v38.03,44.32 38.03,39.14 40.16,37.01 44.81,37.01 v46.99,34.82
IO15/HNSS0  (via drill 0.3)
  Top 0.254: P5.9 38.78,48.13 v38.87,48.21 | U1.8 v26.9,66.93
  Bottom 0.254: v38.87,48.21 38,49.07 23.32,49.07 21.57,50.83 21.57,54.86 26.9,60.2 v26.9,66.93
IO18  (via drill 0.3)
  Top 0.254: R6.1 v12.93,12.9 | v22.25,63.07 23.43,63.07 U1.11
  Bottom 0.254: v12.93,12.9 11.08,14.76 11.08,59.59 14.56,63.07 v22.25,63.07
IO21/LCD_RS
  Top 0.254: U1.23 35.41,55.19 37.82,52.78 37.82,50.52 37.97,50.37 38.28,50.06 | 38.28,50.06 R34.2 | P5.10 38.28,50.06
IO38/TWI_SDA  (via drill 0.3)
  Top 0.254: U8.9 50.31,28.16 50.6,27.86 50.6,24.36 | P2.2 39.74,24.96 v40.29,24.41 | v56.59,43.48 56.58,43.5 P4.22 50.23,43.5 v50.12,43.38 | U1.31 40.96,64.41 38.38,64.41 37.75,63.78 v37.75,60.12 | J3.15 17.43,39.62 v17.43,40.18 | 50.6,24.36 50.6,22.93 R44.1 | v50.52,24.41 50.55,24.41 50.6,24.36
  Bottom 0.254: v56.59,43.48 56.59,26.04 54.97,24.41 v50.52,24.41 v40.29,24.41 21.34,24.41 17.43,28.32 v17.43,40.18 | v37.75,60.12 37.85,60.12 48.11,49.86 48.11,45.39 v50.12,43.38
IO39/TWI_SCK  (via drill 0.3)
  Top 0.254: U8.10 v49.62,25.02 | v49.62,25.02 49.62,22.31 R43.1 | P2.3 40.24,26.49 | 40.24,26.49 40.24,25.6 v40.82,25.02 | v49.61,25.02 v49.62,25.02 | v56.04,44.22 55.76,44.5 P4.20 50.14,44.5 v50.04,44.6 | 40.24,26.49 | v37.14,60.81 37.14,64.14 38.66,65.66 U1.32 | J3.14 17.43,41.76 18.14,41.76 v18.14,41.15
  Bottom 0.254: v56.04,44.22 56.04,26.44 54.61,25.02 v49.61,25.02 v40.82,25.02 40.8,24.99 21.62,24.99 18.14,28.47 v18.14,41.15 | v37.14,60.81 37.95,60.81 48.62,50.14 48.62,46.02 v50.04,44.6
IO40  (via drill 0.3)
  Top 0.254: P2.4 40.74,26.12 v41.18,25.68 | 48.49,29.16 U8.7 51.21,29.16 51.82,28.55 v51.82,25.68 51.82,24.87 R42.1 | 48.49,29.16 48.21,29.16 R3.2 | v46.31,43.54 46.31,36.8 44.68,35.18 v44.68,29.26 | v48.52,29.26 48.52,29.18 48.49,29.16 | v36.55,60.2 36.55,64.52 38.97,66.93 U1.33
  Bottom 0.254: v41.18,25.68 v51.82,25.68 | v44.68,29.26 v48.52,29.26 | v46.31,43.54 46.31,49.1 36.55,58.85 v36.55,60.2
IO41/MISO  (via drill 0.3)
  Top 0.254: v46.51,65.15 SD.7 42.91,65.16 42.85,65.1 | D4.6 55.73,57.94 v55.73,57.33 | R70.1 42.85,60.32 42.85,64.75 42.85,64.82 | 42.85,64.82 42.85,65.1 | 42.85,65.1 42.85,65.53 | 42.85,65.53 42.85,67.33 41.99,68.2 U1.34 | 42.85,65.53 43.21,65.18 42.85,64.82
  Bottom 0.254: v46.51,65.15 46.51,64.97 54.64,56.84 55.25,56.84 v55.73,57.33
IO42/SCLK  (via drill 0.3)
  Top 0.254: U1.35 41.89,69.47 43.97,67.39 45.06,67.39 SD.5 47.17,67.36 47.83,66.7 47.83,66.37 v47.83,65.86 47.83,61.19 46.64,59.99 R69.1 | D4.5 54.64,57.8 v54.94,57.51
  Bottom 0.254: v54.94,57.51 47.83,64.62 v47.83,65.86
IO45  (via drill 0.3)
  Top 0.254: R8.2 R50.2 43.36,20.07 45.9,22.61 45.9,35.46 46.92,36.47 v46.92,43.97 | U1.26 v39.22,57.05 39.22,56.67 39.22,55.91 R7.1
  Bottom 0.254: v46.92,43.97 46.92,49.35 v39.22,57.05
IO47/SPI_NCS2  (via drill 0.3)
  Top 0.254: v47.81,33.55 U9.15 50.42,33.55 51.47,32.51 R54.1 | v36.68,54.86 U1.24
  Bottom 0.254: v47.81,33.55 48.01,33.55 48.26,33.81 48.26,35.41 45.65,38.02 40.62,38.02 39.3,39.34 39.3,46.74 40.01,47.45 40.01,51.54 v36.68,54.86
IO48  (via drill 0.3)
  Top 0.254: U1.25 37.95,58.9 37.42,59.44 v31.32,59.44 | R41.2 v31.32,52.83
  Bottom 0.254: v31.32,59.44 v31.32,52.83
N$1
  Top 0.254: IC1.16 C18.1
N$2
  Top 0.254: Q4.1 16.29,3.97 R26.1
N$3
  Top 0.254: Q3.1 13.9,9.38 R25.1
N$4
  Top 0.254: P5.14 36.28,48.96 D6.+ 35.3,49.94 R2.2
N$5
  Top 0.254: Q2.1 32.12,18.22 R45.2 R50.1
N$6
  Top 0.254: R24.1 12.89,11.16 BOOT.2
N$7
  Top 0.254: PWR.C R16.2
N$8
  Top 0.254: R51.2 31.34,12.71 LED1.1
N$9
  Top 0.254: Q2.3 35.7,14.07 LED1.2
N$10
  Top 0.254: USB-TTL.A5 15.8,21.25 R46.1
N$11
  Top 0.254: USB-TTL.B5 15.64,18.25 R48.1
N$12
  Top 0.254: IC1.7 R27.2 21.53,14.79 R28.2
  pour Top: 21.54,18.87 21.29,18.87 20.91,18.49 20.91,14.27 22.08,14.27 22.08,16.51 21.54,16.94
N$14
  Top 0.305: USB.A5 16.09,32.95 R15.2
N$15  (via drill 0.3)
  Top 0.254: v22.38,60.58 U1.13 | R20.2 v18.75,31.65
  Bottom 0.254: v18.75,31.65 18.75,56.95 v22.38,60.58
N$16  (via drill 0.3)
  Top 0.254: v22.36,59.31 U1.14 | R5.2 v19.36,30.12
  Bottom 0.254: v22.36,59.31 19.36,56.31 v19.36,30.12
N$17
  Top 0.305: USB.B5 14.96,29.95 R14.2
N$18
  Top 0.254: IC1.21 23.03,24.04 R29.2
N$19
  Top 0.254: IC1.20 23.53,23.87 R30.2
N$20
  Top 0.254: P5.34 26.28,47.82 26.67,48.21 28.15,48.21 R37.1
N$21
  Top 0.254: P5.35 25.78,48.11 26.42,48.74 27.17,48.74 R38.1
N$22
  Top 0.254: P5.36 25.28,48.34 26.66,49.72 R39.1
N$23
  Top 0.254: R40.1 25.28,54.42 Q5.1 29.51,54.55 R41.1
N$24
  Top 0.254: R39.2 27.61,51.29 | 27.61,51.29 R38.2 | R38.2 R37.2 | Q5.3 27.61,51.29 | 27.61,51.79 27.61,51.69 | 27.61,51.69 27.23,51.31 | 27.61,51.69 27.61,51.64 27.94,51.31 28.19,51.31 R38.2
N$25
  Top 0.254: R49.2 48.24,28.66 U8.8 50.9,28.66 51.18,28.37 51.18,23.92 R52.1
N$26  (via drill 0.3)
  Top 0.254: R10.1 R9.1 21.34,36.3 v26.75,41.71 | v26.75,45.14 26.78,45.17 P5.33
  Bottom 0.254: v26.75,41.71 v26.75,45.14
N$47
  Top 0.254: SD.1 48.51,71.76 51.64,68.63 51.64,59.66 R72.1
N$48
  Top 0.254: R71.1 44.83,59.95 44.83,60.3 43.62,61.52 43.62,63.6 44.07,64.06 SD.8
PWDN
  Top 0.254: P4.17 49.03,46 R32.1
RESET  (via drill 0.3)
  Top 0.254: R23.1 R33.1 18.98,3.96 R4.1 v17.96,4.19 | R23.1 20.36,5.24 | v35.61,48.26 35.78,48.09 P5.15 v35.78,45.09 v35.79,45.09 | v45.29,30.99 45.29,28.75 44.96,28.42 41.63,28.42 | U1.3 23.51,73.3 v24.54,73.3 | 41.63,28.42 41.3,28.42 | 41.3,28.42 40.82,28.42 | 40.82,28.42 35.88,28.42 R47.1 C8.1 30.81,27.69 30.03,26.9 v30.03,23.01 | P2.5 41.24,28.36 41.3,28.42 | v20.37,5.33 R23.1 | C28.1 11.53,4.92 | 11.53,4.92 Q4.3 v11.79,4.93 11.79,5.03 11.81,5.05 | RST.2 11.55,4.94 11.53,4.92 | 40.82,28.42 41.23,28.02 41.63,28.42 | 11.53,5.33 11.81,5.05 | 11.81,5.05 12.4,5.05
  Bottom 0.254: v35.79,45.09 35.79,39.88 39.68,35.99 44.07,35.99 45.29,34.77 v45.29,30.99 | v24.54,73.3 25.07,73.84 26.01,73.84 26.29,73.56 26.29,60.4 21.06,55.17 21.06,50.09 22.89,48.26 v35.61,48.26 | v20.37,5.33 30.03,14.99 v30.03,23.01 | v17.96,4.19 12.53,4.19 v11.79,4.93
RTS  (via drill 0.3)
  Top 0.254: v13.9,7.17 13.9,6.71 Q4.2 | R25.2 13.9,7.29 v13.9,7.17 | v24.23,23.39 24.03,23.18 IC1.19 | v13.9,7.17 v13.9,7.16
  Bottom 0.254: v24.23,23.39 24.03,23.19 24.03,10.11 21.09,7.16 v13.9,7.16
RXD/IO44  (via drill 0.3)
  Top 0.254: U1.36 38.71,70.74 36.83,72.62 v25.07,72.62 | R29.1 22.47,27.77 v22.48,27.79
  Bottom 0.254: v25.07,72.62 25.07,60.83 19.97,55.73 19.97,29.72 21.9,27.79 v22.48,27.79
TXD/IO43  (via drill 0.3)
  Top 0.254: U1.37 39.17,72.01 38.33,72.01 37.11,73.23 v25.68,73.23 | R30.1 24.29,26.15 v24.29,28.4
  Bottom 0.254: v25.68,73.23 25.68,60.66 20.5,55.47 20.5,30.02 22.13,28.4 v24.29,28.4
USB_D+
  Top 0.305: R5.1 15.51,30.95 USB.B6 12.69,30.95 12.53,31.11 12.53,31.75 12.73,31.95 USB.A6
USB_D-
  Top 0.254: 15.37,31.45 14.96,31.85 14.99,31.85 | 14.99,31.85 15.01,31.88 14.99,31.9 14.99,32.21 | 14.99,31.85 14.58,31.45 14.51,31.45
  Top 0.305: USB.A7 15.01,31.45 | 15.01,31.45 16.11,31.45 R20.1 | USB.B7 14.75,32.45 14.99,32.21 14.99,31.85 14.99,31.48 15.01,31.45
VBUS  (via drill 0.3)
  Top 0.254: D5.A 25.63,16.2 R27.1 22.48,16.94 | IC1.8 22.03,17.39 22.48,16.94 | C25.1 16.2,23.25 16.16,23.29 v16.16,24 | v22.75,17.28 22.75,17.21 22.48,16.94
  Top 0.61: USB-TTL.VBUS1 15.06,22.45 16.16,23.55 v16.16,24 | USB-TTL.VBUS2 15.99,17.55 v16.16,17.39 C15.1
  Bottom 0.254: 22.79,17.17 22.79,17.24 v22.75,17.28
  Bottom 0.61: v16.16,17.39 v16.16,17.4 16.5,17.74 | 16.18,18.47 16.06,18.34 16.06,17.22 16.11,17.17 22.79,17.17
  Bottom 0.813: v22.75,17.28 16.96,17.28 16.5,17.74 16.16,18.09 v16.16,24
  other vias: 22.16,17.44
  pour Top: 22,18.87 22,17.3 22.63,16.59 22.66,14.86 27.05,14.86 27.05,17.32 22.69,17.32 22.18,17.83 22.18,18.87
XL  (via drill 0.3)
  Top 0.254: v52.2,34.85 U9.4 | P5.1 42.78,43.2 45.24,40.74 v45.24,40.18 | U8.4 52.3,29.16 v52.2,29.26
  Bottom 0.254: v52.2,29.26 v52.2,34.85 52.2,38.56 50.57,40.18 v45.24,40.18
XR  (via drill 0.3)
  Top 0.254: P5.3 41.78,42.42 v42.78,41.43 | U9.2 54.6,33.58 v53.42,33.58 | U8.2 53.1,28.16 v52.91,27.96
  Bottom 0.254: v52.91,27.96 53.42,28.47 v53.42,33.58 53.42,38.96 51.08,41.3 42.9,41.3 v42.78,41.43
YD  (via drill 0.3)
  Top 0.254: U8.3 52.64,28.66 v52.53,28.55 | v52.81,34.21 54.61,34.21 U9.3 | P5.4 41.28,41.85 v42.35,40.79
  Bottom 0.254: v52.53,28.55 52.81,28.83 v52.81,34.21 52.81,38.76 50.78,40.79 v42.35,40.79
YU  (via drill 0.3)
  Top 0.254: U8.5 52.72,29.66 52.43,29.95 v51.59,29.95 | v51.59,35.51 U9.5 | P5.2 42.28,42.91 44.53,40.66 v44.53,39.75
  Bottom 0.254: v51.59,29.95 v51.59,35.51 51.59,38.02 50.04,39.57 44.71,39.57 v44.53,39.75

### Text on the board
tPlace: +3V3 | GND | IO16 | IO8 | IO46 | IO9 | IO17 | IO11 | IO10 | IO6 | IO4 | IO5 | IO7 | IO39 | IO38 | ESP32-S3 TFT Touch | v1.1 | (3.5'' ili9488) | www.makerfabs.com